# EAGLE design 18500_pack_v1 (EAGLE 9.6.2)
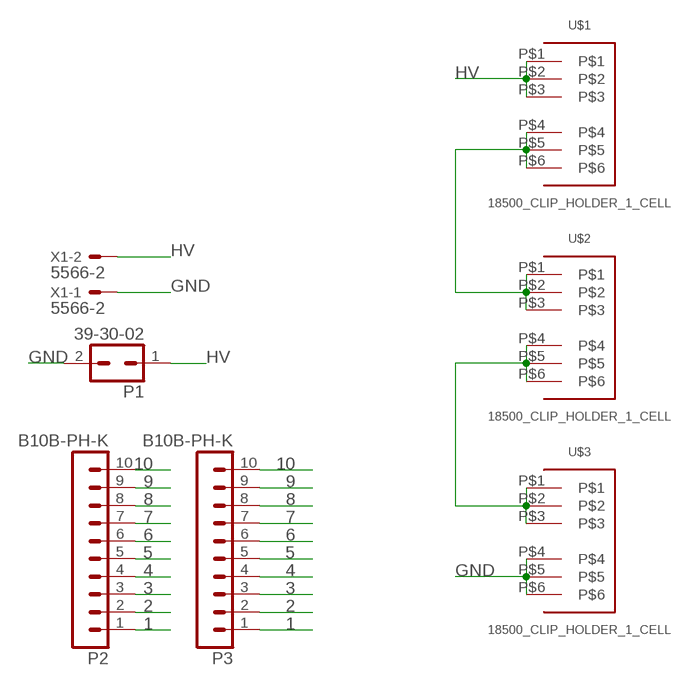
[diagram p0: schematic, sheet 1]

## Parts
P1  39-30-02  [39-30-?02?]
P2  B10B-PH-K  [B10B-PH-K]
P3  B10B-PH-K  [B10B-PH-K]
U$1  18500_CLIP_HOLDER_1_CELL  [3PINBATTERY_CLIP_1_CELL_18500]
U$2  18500_CLIP_HOLDER_1_CELL  [3PINBATTERY_CLIP_1_CELL_18500]
U$3  18500_CLIP_HOLDER_1_CELL  [3PINBATTERY_CLIP_1_CELL_18500]
X1  5566-2  [5566-2]

## Nets
1: P2.1 P3.1
2: P2.2 P3.2
3: P2.3 P3.3
4: P2.4 P3.4
5: P2.5 P3.5
6: P2.6 P3.6
7: P2.7 P3.7
8: P2.8 P3.8
9: P2.9 P3.9
10: P2.10 P3.10
GND: P1.2 U$3.P$4 U$3.P$5 U$3.P$6 X1.1
HV: P1.1 U$1.P$1 U$1.P$2 U$1.P$3 X1.2
N$1: U$1.P$4 U$1.P$5 U$1.P$6 U$2.P$1 U$2.P$2 U$2.P$3
N$2: U$2.P$4 U$2.P$5 U$2.P$6 U$3.P$1 U$3.P$2 U$3.P$3

## Library data of the parts
P1 = con-molex-mini-fit:39-30-?02?: HEADER
P2 P3 = con-jst-ph:B10B-PH-K: HEADER
U$1-U$3 = nathans-custom-parts:18500_CLIP_HOLDER_1_CELL
X1 = con-molex:5566-2: Mini FIT connector 2 pol Source: http://www.molex.com; MF: MOLEX; OC_FARNELL: 1822072; OC_NEWARK: unknown

## Board
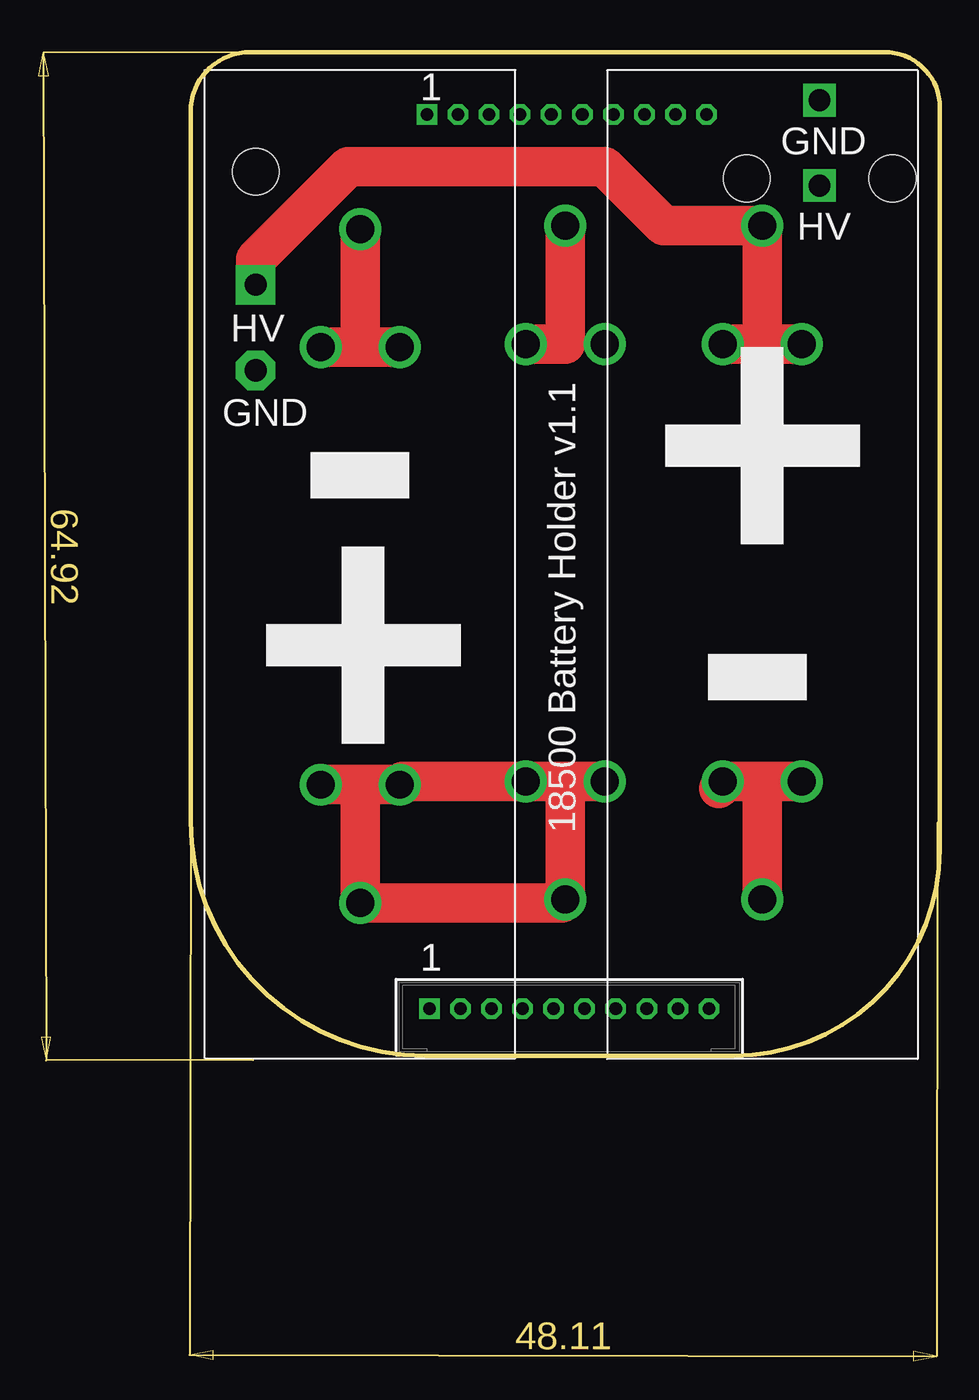
[diagram p1: board, top side]
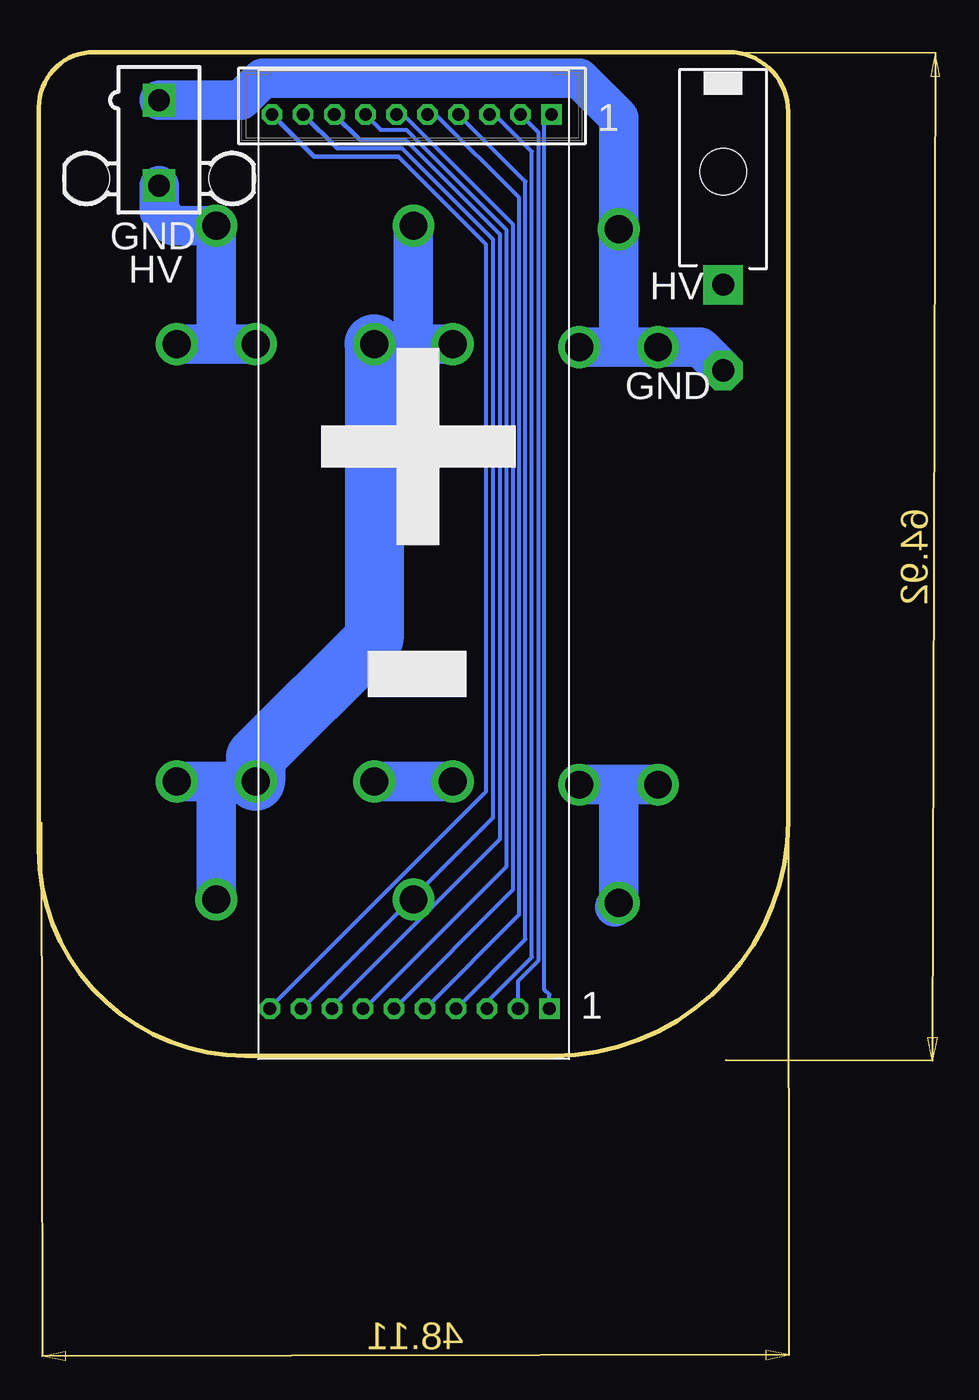
[diagram p2: board, bottom side, seen from below]

Size 48.26 x 64.67 mm. Coordinates in mm from the lower left corner, seen from the top.
Outline: 48.26,13.29 48.26,61.12 arc90 44.72,64.67 3.83,64.67 arc90 0,60.83 0,15.11 arc90 15.11,0 34.97,0 arc90 48.26,13.29
Copper layers (1*16): Top 0.035mm / dielectric 1.5mm / Bottom 0.035mm
Design rules "SeeedStudio_2layer_DRU_no_angle_20140221": minimum track width 6mil, minimum drill 12mil, track to track 6mil, track to pad 6mil, pad to pad 6mil, via to via 6mil, smd to smd 0mil, copper to edge 10mil, drill to drill 10mil, minimum pad ring 10mil, minimum via ring 6mil, stop-mask expansion 2mil, vias tented up to drill 100mil, thermal gap 10mil

### Footprints (pad centres in the part's own frame; a part is rotated, then mirrored left to right if it is on the bottom)
39-30-?02? = drill 1.422 pad 2.54 square: 1 0,0 | drill 1.422 pad 2.54 octagon: 2 0,5.512 | hole 3: 0,-7.3
B10B-PH-K = drill 0.813 square: 1 -9,0 | drill 0.813 octagon: 2 -7,0; 3 -5,0; 4 -3,0; 5 -1,0; 6 1,0; 7 3,0; 8 5,0; 9 7,0; 10 9,0
3PINBATTERY_CLIP_1_CELL_18500 = drill 1.8: P$1 0,0; P$2 7.62,2.54; P$3 7.62,-2.54; P$4 35.801,2.54; P$5 35.801,-2.54; P$6 43.421,0
5566-2 = drill 1.4 square: 1 0,-2.75; 2 0,2.75 | hole 3: 4.7,2.29; -4.7,2.29

### Placement (x,y rotation side)
P1  39-30-02?  [39-30-?02?]  4.19,49.68 180 bottom
P2  24.23,60.65 180 bottom
P3  24.38,3.05 0 top
U$1  36.83,53.49 270 top
U$2  24.13,53.49 270 bottom
U$3  10.92,9.85 90 top
X1  40.51,58.83 180 bottom

### Tracks (layer width: path | path; a pad name or v marks a point on that pad's centre or on a via)
1
  Bottom 0.254: P3.1 15.38,3.95 15.7,4.27 15.7,60.19 P2.1
2
  Bottom 0.254: P3.2 17.38,4.83 16.1,6.11 16.1,59.53 P2.2
3
  Bottom 0.254: 19.38,3.48 16.51,6.35 16.51,58.26 18.9,60.65 P2.3
  Bottom 0.305: P3.3 19.38,3.48
4
  Bottom 0.254: P3.4 16.92,7.52 16.92,56.34 P2.4
5
  Bottom 0.254: P3.5 17.32,9.11 17.32,55.29 22.68,60.65
  Bottom 0.305: 22.68,60.65 P2.5
6
  Bottom 0.254: P2.6 24.8,60.65 17.74,53.59 17.74,10.69 P3.6
7
  Bottom 0.254: P3.7 27.3,3.05 18.16,12.19 18.16,53.23 24.59,59.66 26.24,59.66 P2.7
8
  Bottom 0.254: P3.8 29.38,3.14 18.57,13.96 18.57,52.94 24.66,59.03
  Bottom 0.305: P2.8 27.61,59.03 24.66,59.03
9
  Bottom 0.254: P3.9 31.32,3.05 19.02,15.34 19.02,52.61 24.88,58.47
  Bottom 0.305: 24.88,58.47 29.05,58.47 P2.9
10
  Bottom 0.254: P3.10 33.38,3.1 19.48,17 19.48,52.32 25.1,57.94
  Bottom 0.305: 25.1,57.94 30.51,57.94 P2.10
GND
  Top 2.54: U$3.P$4 10.87,45.66 | 10.87,45.66 U$3.P$5 | U$3.P$6 10.92,45.71 10.87,45.66
  Bottom 2.54: X1.1 35.26,61.58 33.84,62.99 13.46,62.99 10.92,60.45 U$3.P$6 10.92,45.87 10.71,45.66 | 10.71,45.66 U$3.P$4 5.68,45.66 P1.2 | U$3.P$5 10.71,45.66
HV
  Top 2.54: U$1.P$3 36.83,45.87 | 36.83,45.87 U$1.P$2 | 36.83,45.87 U$1.P$1 30.48,53.49 26.67,57.3 10.16,57.3 4.19,51.33 P1.1
  Bottom 2.54: 36.83,46.07 U$1.P$1 39.62,53.49 40.51,54.38 X1.2 | U$1.P$3 36.63,45.87 36.83,46.07 | U$1.P$2 37.03,45.87 36.83,46.07
N$1
  Top 2.54: U$2.P$2 24.13,45.87 U$2.P$1 | U$1.P$4 36.63,17.69 | 36.63,17.69 34.51,17.69 34.04,17.22 | U$1.P$6 36.83,17.49 36.63,17.69
  Bottom 2.54: U$2.P$2 23.82,45.87 | 23.82,45.87 U$2.P$3 | U$2.P$1 24.13,46.18 23.82,45.87 | U$1.P$5 36.68,17.69 | 36.68,17.69 U$1.P$4 | U$1.P$6 36.83,17.54 36.68,17.69
  Bottom 3.81: U$2.P$3 26.67,26.87 34.29,19.25 U$1.P$5
N$2
  Top 2.54: U$3.P$2 10.67,17.48 | 10.67,17.48 U$3.P$3 13.68,17.69 U$2.P$4 23.82,17.69 | 10.67,17.48 10.92,17.22 U$3.P$1 23.91,9.86 U$2.P$6 24.13,17.39 23.82,17.69 | 23.82,17.69 U$2.P$5
  Bottom 2.54: U$3.P$3 10.82,17.48 | 10.82,17.48 U$3.P$2 | 11.18,9.6 U$3.P$1 10.92,17.37 10.82,17.48 | U$2.P$5 U$2.P$4

### Text on the board
tNames: 1 | GND | HV | HV | GND | - | + | + | - | 18500 Battery Holder v1.1 | 1
bNames: 1 | GND | HV | HV | GND | + | - | 1